# EAGLE schematic SAMD21_MINIMAL (EAGLE 8.5.2)
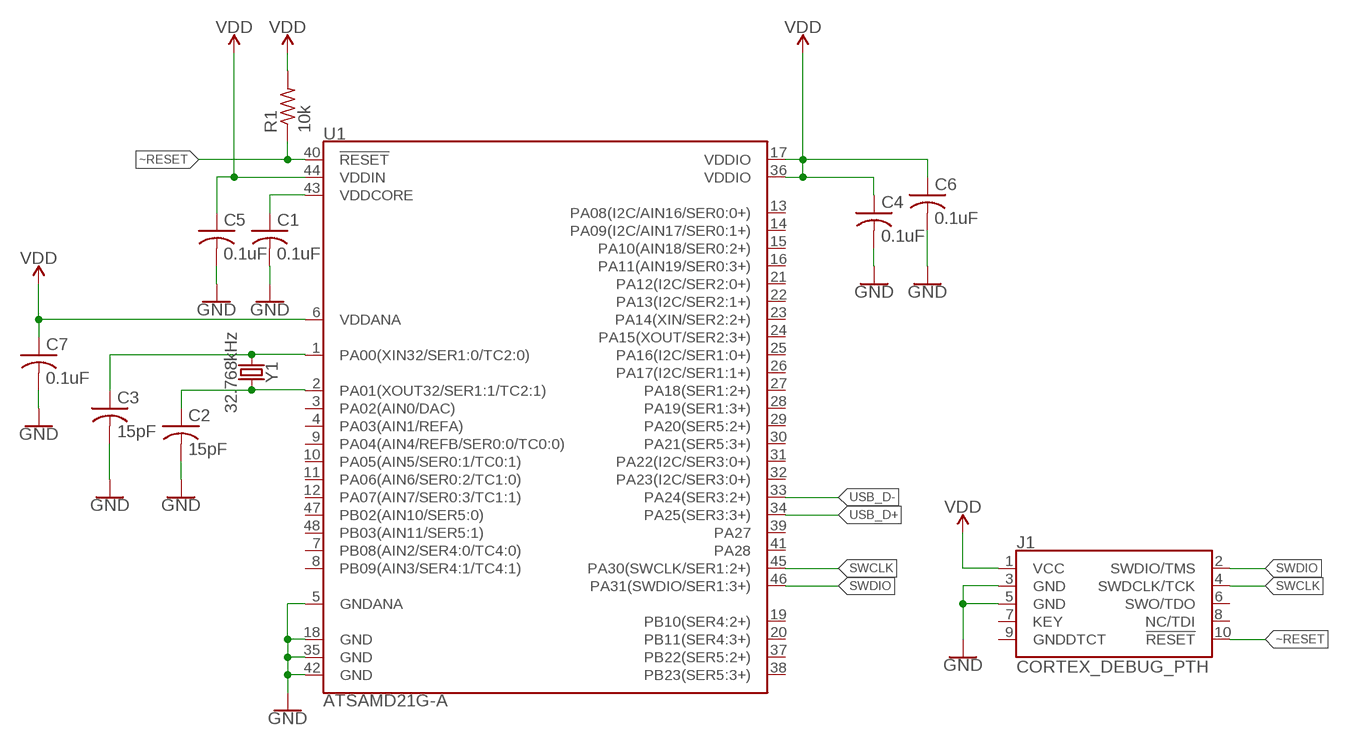
[diagram p0: schematic, sheet 1]

## Parts
C1  0.1uF  C-USC0805  [C0805]
C2  15pF  C-USC0805  [C0805]
C3  15pF  C-USC0805  [C0805]
C4  0.1uF  C-USC0805  [C0805]
C5  0.1uF  C-USC0805  [C0805]
C6  0.1uF  C-USC0805  [C0805]
C7  0.1uF  C-USC0805  [C0805]
J1  CORTEX_DEBUG_PTH  [2X5-PTH-1.27MM]
R1  10k  R-US_R0805  [R0805]
U1  ATSAMD21G-A  [TQFP-48]
Y1  32.768kHz  CRYSTAL-32.768KHZSMD-MC146  [CRYSTAL-SMD-MC-146]

## Nets
GND: C1.2 C2.2 C3.2 C4.2 C5.2 C6.2 C7.2 J1.3(GND) J1.5(GND) U1.5(GNDANA) U1.18(GND) U1.35(GND) U1.42(GND)
N$1: C1.1 U1.43(VDDCORE)
N$2: C2.1 U1.2(PA01(XOUT32/SER1:1/TC2:1)) Y1.P$1
N$4: C3.1 U1.1(PA00(XIN32/SER1:0/TC2:0)) Y1.P$2
SWCLK: J1.4(SWDCLK/TCK) U1.45(PA30(SWCLK/SER1:2+))
SWDIO: J1.2(SWDIO/TMS) U1.46(PA31(SWDIO/SER1:3+))
USB_D+: U1.34(PA25(SER3:3+))
USB_D-: U1.33(PA24(SER3:2+))
VDD: C4.1 C5.1 C6.1 C7.1 J1.1(VCC) R1.2 U1.6(VDDANA) U1.17(VDDIO) U1.36(VDDIO) U1.44(VDDIN)
~RESET: J1.10(!RESET) R1.1 U1.40(!RESET!)
Unconnected: J1.6(SWO/TDO) J1.7(KEY) J1.8(NC/TDI) J1.9(GNDDTCT) U1.3(PA02(AIN0/DAC)) U1.4(PA03(AIN1/REFA)) U1.7(PB08(AIN2/SER4:0/TC4:0)) U1.8(PB09(AIN3/SER4:1/TC4:1)) U1.9(PA04(AIN4/REFB/SER0:0/TC0:0)) U1.10(PA05(AIN5/SER0:1/TC0:1)) U1.11(PA06(AIN6/SER0:2/TC1:0)) U1.12(PA07(AIN7/SER0:3/TC1:1)) U1.13(PA08(I2C/AIN16/SER0:0+)) U1.14(PA09(I2C/AIN17/SER0:1+)) U1.15(PA10(AIN18/SER0:2+)) U1.16(PA11(AIN19/SER0:3+)) U1.19(PB10(SER4:2+)) U1.20(PB11(SER4:3+)) U1.21(PA12(I2C/SER2:0+)) U1.22(PA13(I2C/SER2:1+)) U1.23(PA14(XIN/SER2:2+)) U1.24(PA15(XOUT/SER2:3+)) U1.25(PA16(I2C/SER1:0+)) U1.26(PA17(I2C/SER1:1+)) U1.27(PA18(SER1:2+)) U1.28(PA19(SER1:3+)) U1.29(PA20(SER5:2+)) U1.30(PA21(SER5:3+)) U1.31(PA22(I2C/SER3:0+)) U1.32(PA23(I2C/SER3:0+)) U1.37(PB22(SER5:2+)) U1.38(PB23(SER5:3+)) U1.39(PA27) U1.41(PA28) U1.47(PB02(AIN10/SER5:0)) U1.48(PB03(AIN11/SER5:1))

## Library data of the parts
C1-C7 = adafruit:C-US: CAPACITOR, American symbol
J1 = SparkFun-Connectors:CORTEX_DEBUG: Cortex Debug Connector - 10 pin Supports JTAG debug, Serial Wire debug, and Serial Wire Viewer. PTH and SMD connector options available. General Connector Information <http://infocenter.arm.com/help/topic/com.arm.doc.faqs/attached/13634/cortex_debug_connectors.pdf> Products: PTH Connector <http://www.digikey.com/product-detail/en/cnc-tech/3220-10-0100-00/1175-1627-ND/3883661> -via Digi-Key SparkFun PSoc <https://www.sparkfun.com/products/13229> SparkFun T <https://www.sparkfun.com/products/13810>
R1 = adafruit:R-US_: RESISTOR, American symbol
U1 = SparkFun-IC-Microcontroller:ATSAMD21G: Atmel SAMD21G SMART ARM-Based Microcontroller The Atmel ® | SMART ™ SAM D21 is a series of low-power microcontrollers using the 32-bit ARM ® Cortex ® -M0+ processor, and ranging from 32- to 64-pins with up to 256KB Flash and 32KB of SRAM. The SAM D21 devices operate at a maximum frequency of 48MHz and reach 2.46 CoreMark/MHz. They are designed for simple and intuitive migration with identical peripheral modules, hex compatible code, identical linear address map and pin compatible migration paths between all devices in the product series. All devices include intelligent and flexible peripherals, Atmel Event System for inter-peripheral signaling, and support for capacitive touch button, slider and wheel user interfaces. Datasheet <https://cdn.sparkfun.com/datasheets/Dev/Arduino/Boards/Atmel-42181-SAM-D21_Datasheet.pdf> SparkFun Products SparkFun SAMD21 Mini Breakout <https://www.sparkfun.com/products/13664> (DEV-13664) SparkFun SAMD21 Dev Breakout <https://www.sparkfun.com/products/13672> (DEV-13672); PROD_ID: IC-13064
Y1 = SparkFun-Clocks:CRYSTAL-32.768KHZ: 32.768kHz Crystal Frequency: 32.768kHz Frequency Stability: ±20ppm Load Capacitance: 12.5pF (PTH-2X6 & SMD-3.2X1.5), 6pF (SMD-2X6) SparkFun Products: SparkFun BigTime Watch Kit <https://www.sparkfun.com/products/11734> SparkFun nRF52832 Breakout <https://www.sparkfun.com/products/13990> SparkFun Real Time Clock Module <https://www.sparkfun.com/products/12708>; PROD_ID: XTAL-09342